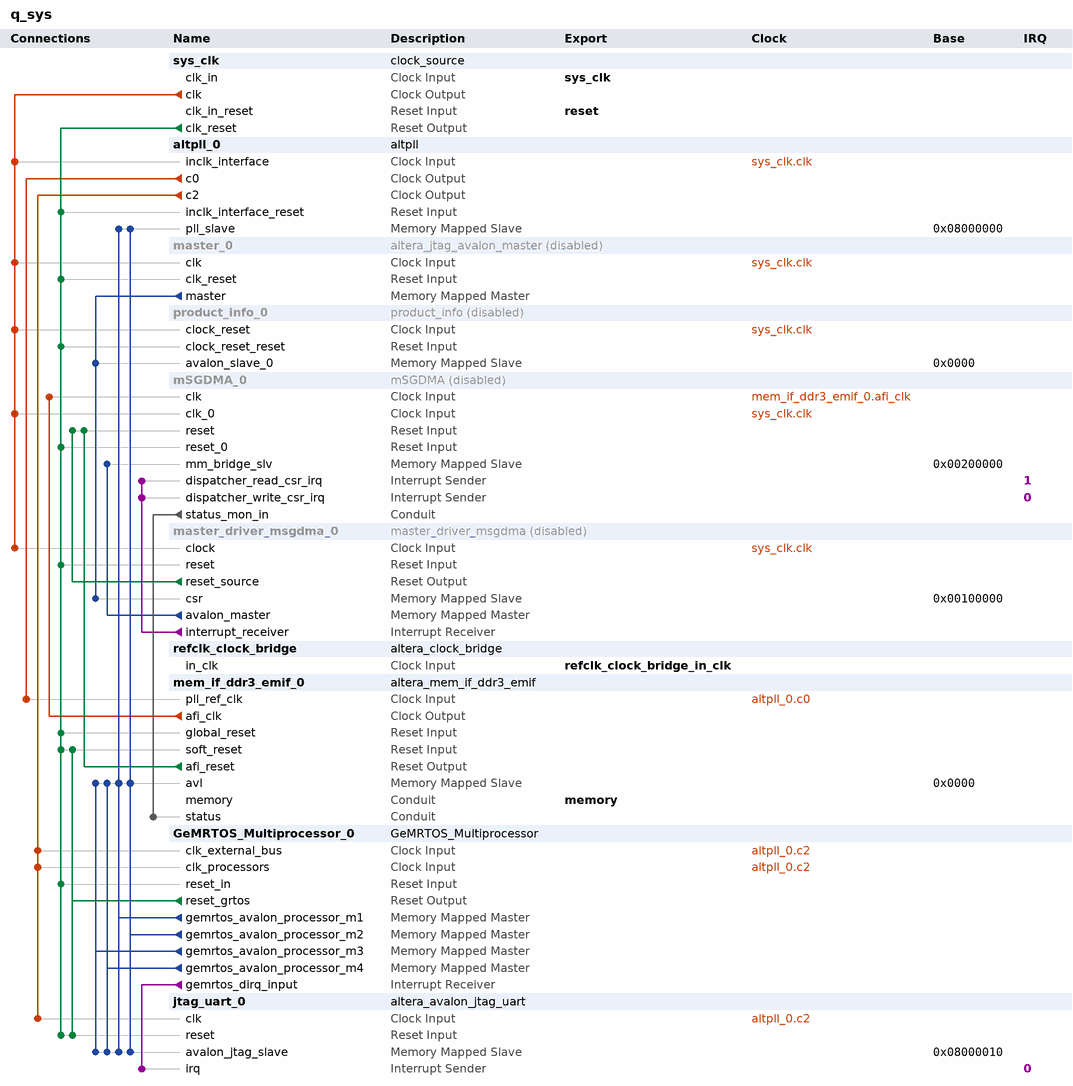
[diagram p0: system contents]
# Platform Designer (Qsys) system q_sys, MAX 10 10M50DAF484C6GES
# Parameters at their usual value, and those the tool derives, are not listed.
package require -exact qsys 23.1
create_system q_sys
set_project_property DEVICE_FAMILY {MAX 10}
set_project_property DEVICE 10M50DAF484C6GES

add_instance sys_clk clock_source 23.1
set_instance_parameter_value sys_clk clockFrequency 50000000

add_instance altpll_0 altpll 23.1
set_instance_parameter_value altpll_0 CLK0_DIVIDE_BY 1
set_instance_parameter_value altpll_0 CLK0_MULTIPLY_BY 1
set_instance_parameter_value altpll_0 CLK1_DIVIDE_BY 5
set_instance_parameter_value altpll_0 CLK1_DUTY_CYCLE 50
set_instance_parameter_value altpll_0 CLK1_MULTIPLY_BY 9
set_instance_parameter_value altpll_0 CLK1_PHASE_SHIFT 0
set_instance_parameter_value altpll_0 CLK2_DIVIDE_BY 1
set_instance_parameter_value altpll_0 CLK2_DUTY_CYCLE 50
set_instance_parameter_value altpll_0 CLK2_MULTIPLY_BY 2
set_instance_parameter_value altpll_0 CLK2_PHASE_SHIFT 0
set_instance_parameter_value altpll_0 INCLK0_INPUT_FREQUENCY 20000
set_instance_parameter_value altpll_0 PORT_ARESET PORT_UNUSED
set_instance_parameter_value altpll_0 PORT_LOCKED PORT_UNUSED
set_instance_parameter_value altpll_0 PORT_clk1 PORT_USED
set_instance_parameter_value altpll_0 PORT_clk2 PORT_USED
set_instance_parameter_value altpll_0 PORT_clk3 PORT_UNUSED

add_instance master_0 altera_jtag_avalon_master 23.1
set_instance_property master_0 ENABLED false

add_instance product_info_0 product_info 1.0
set_instance_property product_info_0 ENABLED false

add_instance mSGDMA_0 mSGDMA 1.0
set_instance_property mSGDMA_0 ENABLED false

add_instance master_driver_msgdma_0 master_driver_msgdma 1.0
set_instance_property master_driver_msgdma_0 ENABLED false
set_instance_parameter_value master_driver_msgdma_0 BLOCK_SIZE 67108864
set_instance_parameter_value master_driver_msgdma_0 DISPATCHER_READ_CSR 2097280
set_instance_parameter_value master_driver_msgdma_0 DISPATCHER_READ_DESCRIPTOR 2097328
set_instance_parameter_value master_driver_msgdma_0 DISPATCHER_WRITE_CSR 2097248
set_instance_parameter_value master_driver_msgdma_0 DISPATCHER_WRITE_DESCRIPTOR 2097312
set_instance_parameter_value master_driver_msgdma_0 ENABLE_PER_INFO 1
set_instance_parameter_value master_driver_msgdma_0 FREQUENCY_COUNTER_BASE 2686976
set_instance_parameter_value master_driver_msgdma_0 LOCAL_DATA_WORDS 8
set_instance_parameter_value master_driver_msgdma_0 MEMORY_BASE_ADDRESS 0
set_instance_parameter_value master_driver_msgdma_0 MEMORY_SPAN 67108864
set_instance_parameter_value master_driver_msgdma_0 PRBS_PATTERN_CHECKER_BASE 2097152
set_instance_parameter_value master_driver_msgdma_0 PRBS_PATTERN_GENERATOR_BASE 2097216
set_instance_parameter_value master_driver_msgdma_0 TIMER_BASE 2625536

add_instance refclk_clock_bridge altera_clock_bridge 23.1
set_instance_parameter_value refclk_clock_bridge DERIVED_CLOCK_RATE 0
set_instance_parameter_value refclk_clock_bridge EXPLICIT_CLOCK_RATE 100000000

add_instance mem_if_ddr3_emif_0 altera_mem_if_ddr3_emif 23.1
set_instance_parameter_value mem_if_ddr3_emif_0 AVL_MAX_SIZE 4
set_instance_parameter_value mem_if_ddr3_emif_0 CALIBRATION_MODE Skip
set_instance_parameter_value mem_if_ddr3_emif_0 CPORT_TYPE_PORT Bidirectional,Bidirectional,Bidirectional,Bidirectional,Bidirectional,Bidirectional
set_instance_parameter_value mem_if_ddr3_emif_0 CTL_CSR_ENABLED true
set_instance_parameter_value mem_if_ddr3_emif_0 EXPORT_AFI_HALF_CLK false
set_instance_parameter_value mem_if_ddr3_emif_0 HARD_EMIF false
set_instance_parameter_value mem_if_ddr3_emif_0 MEM_BANKADDR_WIDTH 3
set_instance_parameter_value mem_if_ddr3_emif_0 MEM_CLK_FREQ 300.0
set_instance_parameter_value mem_if_ddr3_emif_0 MEM_CLK_FREQ_MAX 800.0
set_instance_parameter_value mem_if_ddr3_emif_0 MEM_COL_ADDR_WIDTH 10
set_instance_parameter_value mem_if_ddr3_emif_0 MEM_DQ_WIDTH 24
set_instance_parameter_value mem_if_ddr3_emif_0 MEM_DRV_STR RZQ/6
set_instance_parameter_value mem_if_ddr3_emif_0 MEM_FORMAT DISCRETE
set_instance_parameter_value mem_if_ddr3_emif_0 MEM_ROW_ADDR_WIDTH 13
set_instance_parameter_value mem_if_ddr3_emif_0 MEM_RTT_NOM {ODT Disabled}
set_instance_parameter_value mem_if_ddr3_emif_0 MEM_RTT_WR {Dynamic ODT off}
set_instance_parameter_value mem_if_ddr3_emif_0 MEM_TCL 5
set_instance_parameter_value mem_if_ddr3_emif_0 MEM_TFAW_NS 30.0
set_instance_parameter_value mem_if_ddr3_emif_0 MEM_TRAS_NS 35.0
set_instance_parameter_value mem_if_ddr3_emif_0 MEM_TRCD_NS 13.75
set_instance_parameter_value mem_if_ddr3_emif_0 MEM_TRFC_NS 110.0
set_instance_parameter_value mem_if_ddr3_emif_0 MEM_TRP_NS 13.75
set_instance_parameter_value mem_if_ddr3_emif_0 MEM_TRRD_NS 6.0
set_instance_parameter_value mem_if_ddr3_emif_0 MEM_TRTP_NS 7.5
set_instance_parameter_value mem_if_ddr3_emif_0 MEM_TWTR 6
set_instance_parameter_value mem_if_ddr3_emif_0 MEM_VENDOR JEDEC
set_instance_parameter_value mem_if_ddr3_emif_0 MEM_WTCL 5
set_instance_parameter_value mem_if_ddr3_emif_0 PLL_LOCATION Top_Bottom
set_instance_parameter_value mem_if_ddr3_emif_0 POWER_OF_TWO_BUS true
set_instance_parameter_value mem_if_ddr3_emif_0 PRIORITY_PORT 1,1,1,1,1,1
set_instance_parameter_value mem_if_ddr3_emif_0 RATE Half
set_instance_parameter_value mem_if_ddr3_emif_0 REF_CLK_FREQ 50.0
set_instance_parameter_value mem_if_ddr3_emif_0 SPEED_GRADE 6
set_instance_parameter_value mem_if_ddr3_emif_0 TIMING_BOARD_AC_SKEW 0.07801
set_instance_parameter_value mem_if_ddr3_emif_0 TIMING_BOARD_AC_TO_CK_SKEW -0.04709
set_instance_parameter_value mem_if_ddr3_emif_0 TIMING_BOARD_DQ_TO_DQS_SKEW -0.01152
set_instance_parameter_value mem_if_ddr3_emif_0 TIMING_BOARD_MAX_CK_DELAY 0.2443
set_instance_parameter_value mem_if_ddr3_emif_0 TIMING_BOARD_MAX_DQS_DELAY 0.21929
set_instance_parameter_value mem_if_ddr3_emif_0 TIMING_BOARD_SKEW_BETWEEN_DQS 0.04246
set_instance_parameter_value mem_if_ddr3_emif_0 TIMING_BOARD_SKEW_CKDQS_DIMM_MAX 0.04429
set_instance_parameter_value mem_if_ddr3_emif_0 TIMING_BOARD_SKEW_CKDQS_DIMM_MIN 0.02286
set_instance_parameter_value mem_if_ddr3_emif_0 TIMING_BOARD_SKEW_WITHIN_DQS 0.01806
set_instance_parameter_value mem_if_ddr3_emif_0 TIMING_TDH 45
set_instance_parameter_value mem_if_ddr3_emif_0 TIMING_TDQSCK 225
set_instance_parameter_value mem_if_ddr3_emif_0 TIMING_TDQSQ 100
set_instance_parameter_value mem_if_ddr3_emif_0 TIMING_TDQSS 0.27
set_instance_parameter_value mem_if_ddr3_emif_0 TIMING_TDS 10
set_instance_parameter_value mem_if_ddr3_emif_0 TIMING_TDSH 0.18
set_instance_parameter_value mem_if_ddr3_emif_0 TIMING_TDSS 0.18
set_instance_parameter_value mem_if_ddr3_emif_0 TIMING_TIH 120
set_instance_parameter_value mem_if_ddr3_emif_0 TIMING_TIS 170
set_instance_parameter_value mem_if_ddr3_emif_0 TIMING_TQSH 0.4
set_instance_parameter_value mem_if_ddr3_emif_0 USER_DEBUG_LEVEL 1

add_instance GeMRTOS_Multiprocessor_0 GeMRTOS_Multiprocessor 1.0
set_instance_parameter_value GeMRTOS_Multiprocessor_0 BUS_WIDTH 28
set_instance_parameter_value GeMRTOS_Multiprocessor_0 CEFrequency 100000000
set_instance_parameter_value GeMRTOS_Multiprocessor_0 CFrequency 100000000
set_instance_parameter_value GeMRTOS_Multiprocessor_0 DEVICE_NAME 10M50DAF484C6GES
set_instance_parameter_value GeMRTOS_Multiprocessor_0 ENABLE_HPS_MAP_ACCESS false
set_instance_parameter_value GeMRTOS_Multiprocessor_0 INCLUDE_JTAG_UART_PROCESSOR true
set_instance_parameter_value GeMRTOS_Multiprocessor_0 INCLUDE_JTAG_UART_STDDIO true
set_instance_parameter_value GeMRTOS_Multiprocessor_0 INCLUDE_JTAG_UART_STDERR true
set_instance_parameter_value GeMRTOS_Multiprocessor_0 INDEPENDENT_EXTERNAL_PROCESSOR_BUSES true
set_instance_parameter_value GeMRTOS_Multiprocessor_0 NProcessors 4
set_instance_parameter_value GeMRTOS_Multiprocessor_0 Processor_type {Nios V/m}
set_instance_parameter_value GeMRTOS_Multiprocessor_0 QSYS_PROJECT_FILE q_sys
set_instance_parameter_value GeMRTOS_Multiprocessor_0 QUARTUS_PROJECT_FILE ddr3
set_instance_parameter_value GeMRTOS_Multiprocessor_0 icache_size_parameter {1 KB}
set_instance_parameter_value GeMRTOS_Multiprocessor_0 pipelineArch_parameter True
set_instance_parameter_value GeMRTOS_Multiprocessor_0 resetOffset 0
set_instance_parameter_value GeMRTOS_Multiprocessor_0 resetSlave mem_if_ddr3_emif_0.avl

add_instance jtag_uart_0 altera_avalon_jtag_uart 23.1
set_instance_parameter_value jtag_uart_0 simInteractiveOptions NO_INTERACTIVE_WINDOWS

# connections
add_connection altpll_0.c0 mem_if_ddr3_emif_0.pll_ref_clk clock
add_connection altpll_0.c2 GeMRTOS_Multiprocessor_0.clk_external_bus clock
add_connection altpll_0.c2 GeMRTOS_Multiprocessor_0.clk_processors clock
add_connection altpll_0.c2 jtag_uart_0.clk clock
add_connection mem_if_ddr3_emif_0.afi_clk mSGDMA_0.clk clock
add_connection sys_clk.clk altpll_0.inclk_interface clock
add_connection sys_clk.clk master_0.clk clock
add_connection sys_clk.clk master_driver_msgdma_0.clock clock
add_connection sys_clk.clk mSGDMA_0.clk_0 clock
add_connection sys_clk.clk product_info_0.clock_reset clock
add_connection GeMRTOS_Multiprocessor_0.reset_grtos jtag_uart_0.reset reset
add_connection GeMRTOS_Multiprocessor_0.reset_grtos mem_if_ddr3_emif_0.soft_reset reset
add_connection master_driver_msgdma_0.reset_source mSGDMA_0.reset reset
add_connection mem_if_ddr3_emif_0.afi_reset mSGDMA_0.reset reset
add_connection sys_clk.clk_reset altpll_0.inclk_interface_reset reset
add_connection sys_clk.clk_reset GeMRTOS_Multiprocessor_0.reset_in reset
add_connection sys_clk.clk_reset jtag_uart_0.reset reset
add_connection sys_clk.clk_reset master_0.clk_reset reset
add_connection sys_clk.clk_reset master_driver_msgdma_0.reset reset
add_connection sys_clk.clk_reset mem_if_ddr3_emif_0.global_reset reset
add_connection sys_clk.clk_reset mem_if_ddr3_emif_0.soft_reset reset
add_connection sys_clk.clk_reset mSGDMA_0.reset_0 reset
add_connection sys_clk.clk_reset product_info_0.clock_reset_reset reset
add_connection GeMRTOS_Multiprocessor_0.gemrtos_avalon_processor_m1 altpll_0.pll_slave avalon
set_connection_parameter_value GeMRTOS_Multiprocessor_0.gemrtos_avalon_processor_m1/altpll_0.pll_slave baseAddress 0x08000000
add_connection GeMRTOS_Multiprocessor_0.gemrtos_avalon_processor_m1 jtag_uart_0.avalon_jtag_slave avalon
set_connection_parameter_value GeMRTOS_Multiprocessor_0.gemrtos_avalon_processor_m1/jtag_uart_0.avalon_jtag_slave baseAddress 0x08000010
add_connection GeMRTOS_Multiprocessor_0.gemrtos_avalon_processor_m1 mem_if_ddr3_emif_0.avl avalon
set_connection_parameter_value GeMRTOS_Multiprocessor_0.gemrtos_avalon_processor_m1/mem_if_ddr3_emif_0.avl baseAddress 0x0000
add_connection GeMRTOS_Multiprocessor_0.gemrtos_avalon_processor_m2 altpll_0.pll_slave avalon
set_connection_parameter_value GeMRTOS_Multiprocessor_0.gemrtos_avalon_processor_m2/altpll_0.pll_slave baseAddress 0x08000000
add_connection GeMRTOS_Multiprocessor_0.gemrtos_avalon_processor_m2 jtag_uart_0.avalon_jtag_slave avalon
set_connection_parameter_value GeMRTOS_Multiprocessor_0.gemrtos_avalon_processor_m2/jtag_uart_0.avalon_jtag_slave baseAddress 0x08000010
add_connection GeMRTOS_Multiprocessor_0.gemrtos_avalon_processor_m2 mem_if_ddr3_emif_0.avl avalon
set_connection_parameter_value GeMRTOS_Multiprocessor_0.gemrtos_avalon_processor_m2/mem_if_ddr3_emif_0.avl baseAddress 0x0000
add_connection GeMRTOS_Multiprocessor_0.gemrtos_avalon_processor_m3 jtag_uart_0.avalon_jtag_slave avalon
set_connection_parameter_value GeMRTOS_Multiprocessor_0.gemrtos_avalon_processor_m3/jtag_uart_0.avalon_jtag_slave baseAddress 0x08000010
add_connection GeMRTOS_Multiprocessor_0.gemrtos_avalon_processor_m3 mem_if_ddr3_emif_0.avl avalon
set_connection_parameter_value GeMRTOS_Multiprocessor_0.gemrtos_avalon_processor_m3/mem_if_ddr3_emif_0.avl baseAddress 0x0000
add_connection GeMRTOS_Multiprocessor_0.gemrtos_avalon_processor_m4 jtag_uart_0.avalon_jtag_slave avalon
set_connection_parameter_value GeMRTOS_Multiprocessor_0.gemrtos_avalon_processor_m4/jtag_uart_0.avalon_jtag_slave baseAddress 0x08000010
add_connection GeMRTOS_Multiprocessor_0.gemrtos_avalon_processor_m4 mem_if_ddr3_emif_0.avl avalon
set_connection_parameter_value GeMRTOS_Multiprocessor_0.gemrtos_avalon_processor_m4/mem_if_ddr3_emif_0.avl baseAddress 0x0000
add_connection master_0.master master_driver_msgdma_0.csr avalon
set_connection_parameter_value master_0.master/master_driver_msgdma_0.csr baseAddress 0x00100000
add_connection master_0.master product_info_0.avalon_slave_0 avalon
set_connection_parameter_value master_0.master/product_info_0.avalon_slave_0 baseAddress 0x0000
add_connection master_driver_msgdma_0.avalon_master mSGDMA_0.mm_bridge_slv avalon
set_connection_parameter_value master_driver_msgdma_0.avalon_master/mSGDMA_0.mm_bridge_slv baseAddress 0x00200000
add_connection mSGDMA_0.status_mon_in mem_if_ddr3_emif_0.status conduit
add_connection GeMRTOS_Multiprocessor_0.gemrtos_dirq_input jtag_uart_0.irq interrupt
set_connection_parameter_value GeMRTOS_Multiprocessor_0.gemrtos_dirq_input/jtag_uart_0.irq irqNumber 0
add_connection master_driver_msgdma_0.interrupt_receiver mSGDMA_0.dispatcher_read_csr_irq interrupt
set_connection_parameter_value master_driver_msgdma_0.interrupt_receiver/mSGDMA_0.dispatcher_read_csr_irq irqNumber 1
add_connection master_driver_msgdma_0.interrupt_receiver mSGDMA_0.dispatcher_write_csr_irq interrupt
set_connection_parameter_value master_driver_msgdma_0.interrupt_receiver/mSGDMA_0.dispatcher_write_csr_irq irqNumber 0

# exported interfaces
add_interface memory conduit end
set_interface_property memory EXPORT_OF mem_if_ddr3_emif_0.memory
add_interface refclk_clock_bridge_in_clk clock sink
set_interface_property refclk_clock_bridge_in_clk EXPORT_OF refclk_clock_bridge.in_clk
add_interface reset reset sink
set_interface_property reset EXPORT_OF sys_clk.clk_in_reset
add_interface sys_clk clock sink
set_interface_property sys_clk EXPORT_OF sys_clk.clk_in

set_interconnect_requirement {$system} qsys_mm.clockCrossingAdapter HANDSHAKE
set_interconnect_requirement {$system} qsys_mm.maxAdditionalLatency 0

save_system q_sys.qsys
